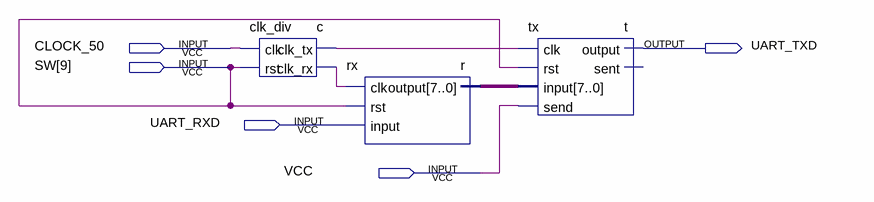
[diagram p0: schematic sheet]
// Quartus schematic uart_tester2.bdf as structural Verilog: 3 symbols, 5 pins
module uart_tester2 (
  input  CLOCK_50,
  input  [9:9] SW,
  input  UART_RXD,
  input  VCC,
  output UART_TXD
);

  wire c_clk_rx, c_clk_tx;
  wire [7:0] r_output;

  clk_div c (.clk(CLOCK_50), .rst(SW[9]), .clk_tx(c_clk_tx), .clk_rx(c_clk_rx));
  rx r (.clk(c_clk_rx), .rst(SW[9]), .\input (UART_RXD), .\output (r_output));
  tx t (.clk(c_clk_tx), .rst(SW[9]), .\input (r_output), .send(VCC), .\output (UART_TXD));  // open: sent
endmodule
